# EAGLE schematic PT8211_T3_0.2 (EAGLE 7.4.0)
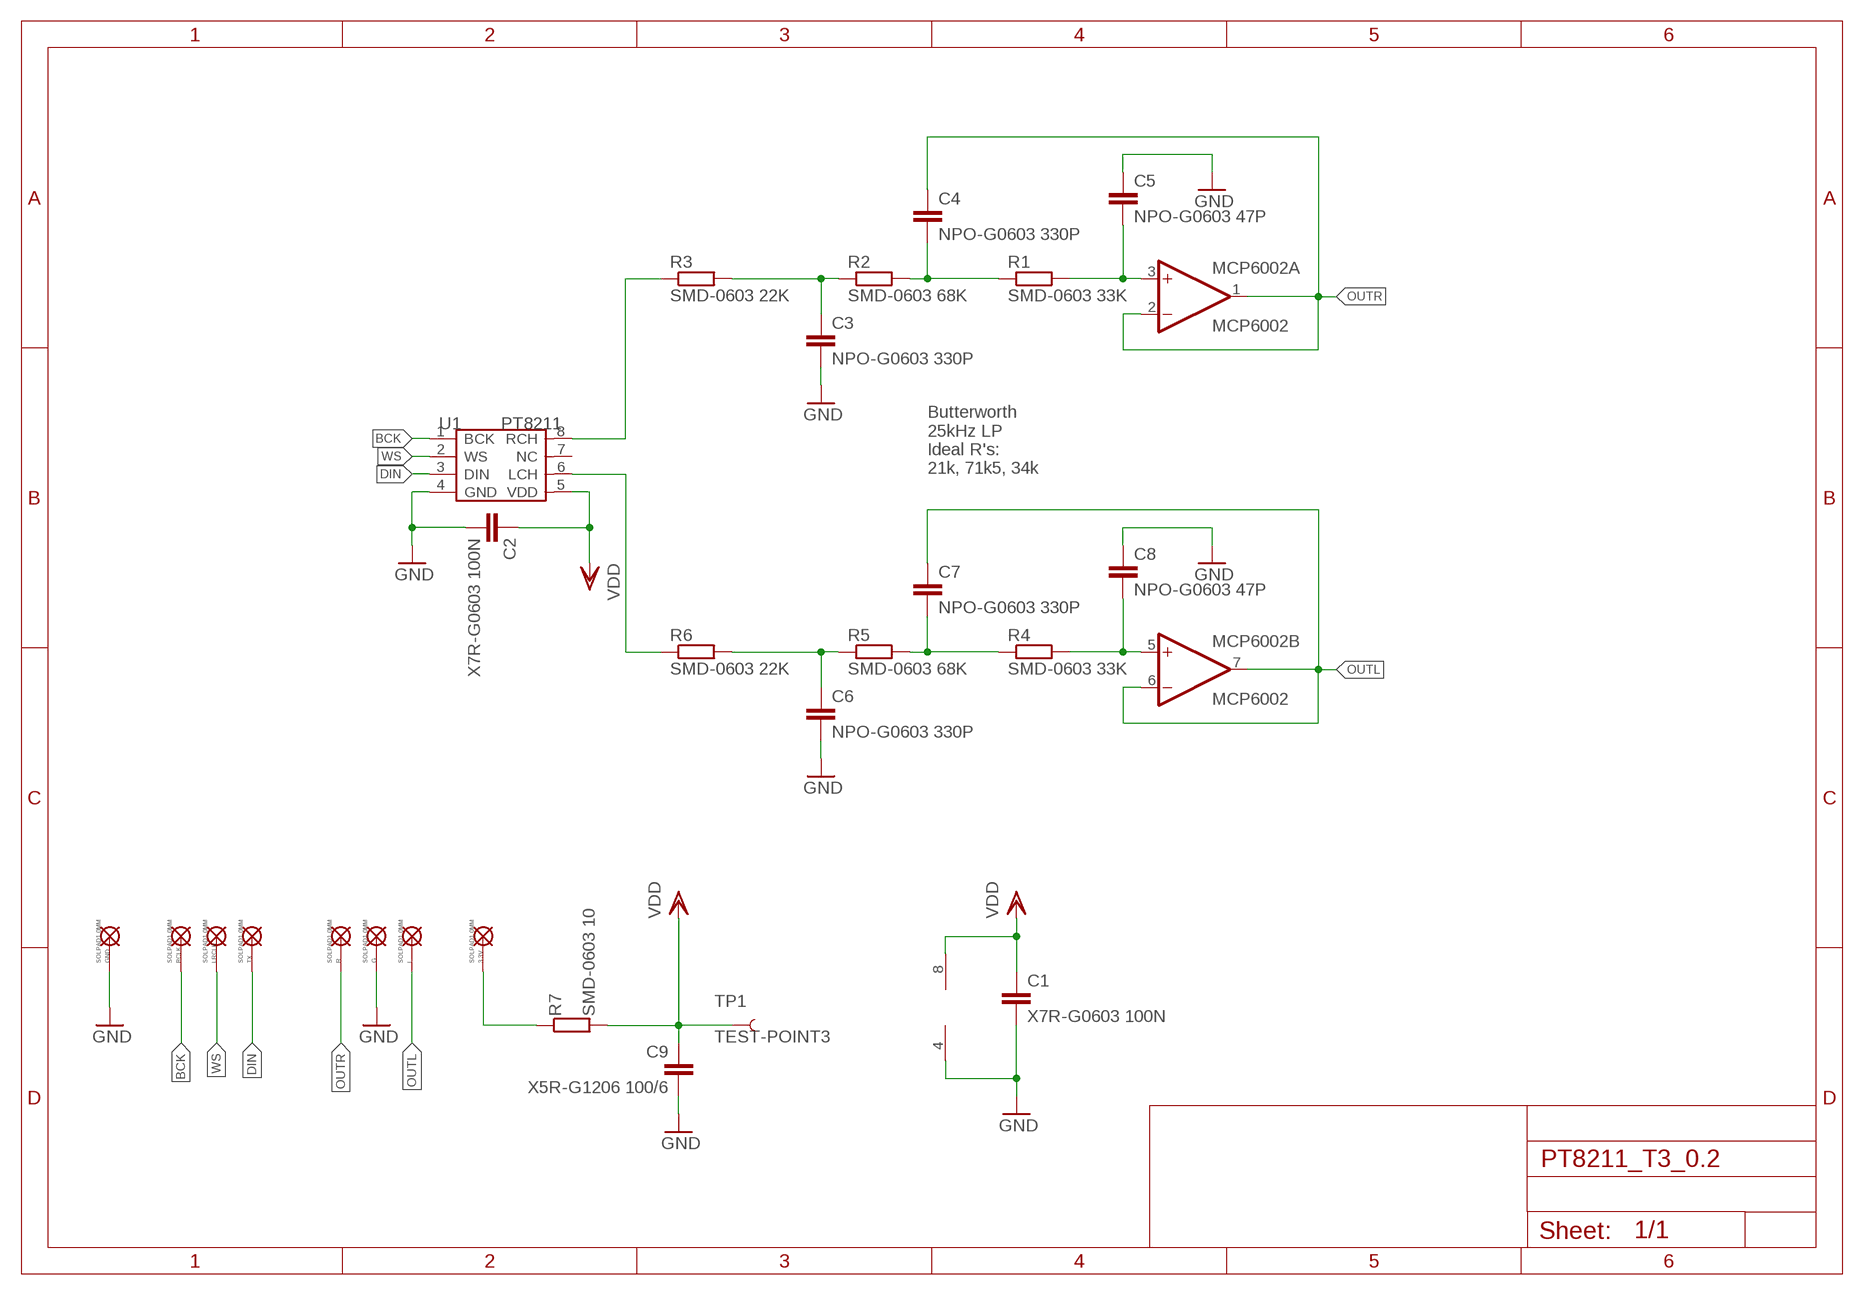
[diagram p0: schematic, sheet 1]

## Parts
3.3V  SOLPAD1,0MM  [SOLPAD1MM]
BCLK  SOLPAD1,0MM  [SOLPAD1MM]
C1  X7R-G0603 100N  C-EUC0603K  [C0603K]
C2  X7R-G0603 100N  C-EUC0603K  [C0603K]
C3  NPO-G0603 330P  C-EUC0603K  [C0603K]
C4  NPO-G0603 330P  C-EUC0603K  [C0603K]
C5  NPO-G0603 47P  C-EUC0603K  [C0603K]
C6  NPO-G0603 330P  C-EUC0603K  [C0603K]
C7  NPO-G0603 330P  C-EUC0603K  [C0603K]
C8  NPO-G0603 47P  C-EUC0603K  [C0603K]
C9  X5R-G1206 100/6  C-EUC1206K  [C1206K]
G  SOLPAD1,0MM  [SOLPAD1MM]
GND  SOLPAD1,0MM  [SOLPAD1MM]
L  SOLPAD1,0MM  [SOLPAD1MM]
LRCLK  SOLPAD1,0MM  [SOLPAD1MM]
MCP6002  MCP6002  MCP602SN  [SO08]
R  SOLPAD1,0MM  [SOLPAD1MM]
R1  SMD-0603 33K  R-EU_R0603  [R0603]
R2  SMD-0603 68K  R-EU_R0603  [R0603]
R3  SMD-0603 22K  R-EU_R0603  [R0603]
R4  SMD-0603 33K  R-EU_R0603  [R0603]
R5  SMD-0603 68K  R-EU_R0603  [R0603]
R6  SMD-0603 22K  R-EU_R0603  [R0603]
R7  SMD-0603 10  R-EU_R0603  [R0603]
TP1  TEST-POINT3  [PAD.03X.03]
TX  SOLPAD1,0MM  [SOLPAD1MM]
U1  PT8211  PT8211-SOP8  [SOP8-6.0-4.9X3.9]

## Nets
BCK: BCLK.P$1 U1.1(BCK)
DIN: TX.P$1 U1.3(DIN)
GND: C1.2 C2.2 C3.2 C5.1 C6.2 C8.1 C9.2 G.P$1 GND.P$1 MCP6002.4(P:V-) U1.4(GND)
N$1: C6.1 R5.1 R6.2
N$2: C7.2 R4.1 R5.2
N$3: C8.2 MCP6002.5(B:+IN) R4.2
N$4: C3.1 R2.1 R3.2
N$5: C4.2 R1.1 R2.2
N$6: C5.2 MCP6002.3(A:+IN) R1.2
N$7: 3.3V.P$1 R7.1
N$9: R6.1 U1.6(LCH)
N$10: R3.1 U1.8(RCH)
OUTL: C7.1 L.P$1 MCP6002.6(B:-IN) MCP6002.7(B:OUT)
OUTR: C4.1 MCP6002.1(A:OUT) MCP6002.2(A:-IN) R.P$1
VDD: C1.1 C2.1 C9.1 MCP6002.8(P:V+) R7.2 TP1.P$1 U1.5(VDD)
WS: LRCLK.P$1 U1.2(WS)
Unconnected: U1.7(NC)

## Notes on the sheet
- Butterworth
  25kHz LP
  Ideal R's:
  21k, 71k5, 34k

## Library data of the parts
3.3V BCLK G GND L LRCLK R TX = Teensy3_MicroSD:SOLPAD
C1-C9 = rcl:C-EU: CAPACITOR, European symbol
MCP6002 = linear:MCP602: Single Op Amp 2.7V to 6.0V Single Supply CMOS Source: http://ww1.microchip.com/downloads/en/DeviceDoc/21314g.pdf
R1-R7 = rcl:R-EU_: RESISTOR, European symbol
TP1 = SparkFun:TEST-POINT
U1 = IC:PT8211: 16 Bit Digital to Analog Converter http://www.princeton.com.tw/downloadprocess/downloadfile.asp? mydownload=PT8211.pdf